# Altium schematic sheet cpu_board.SchDoc
size A3
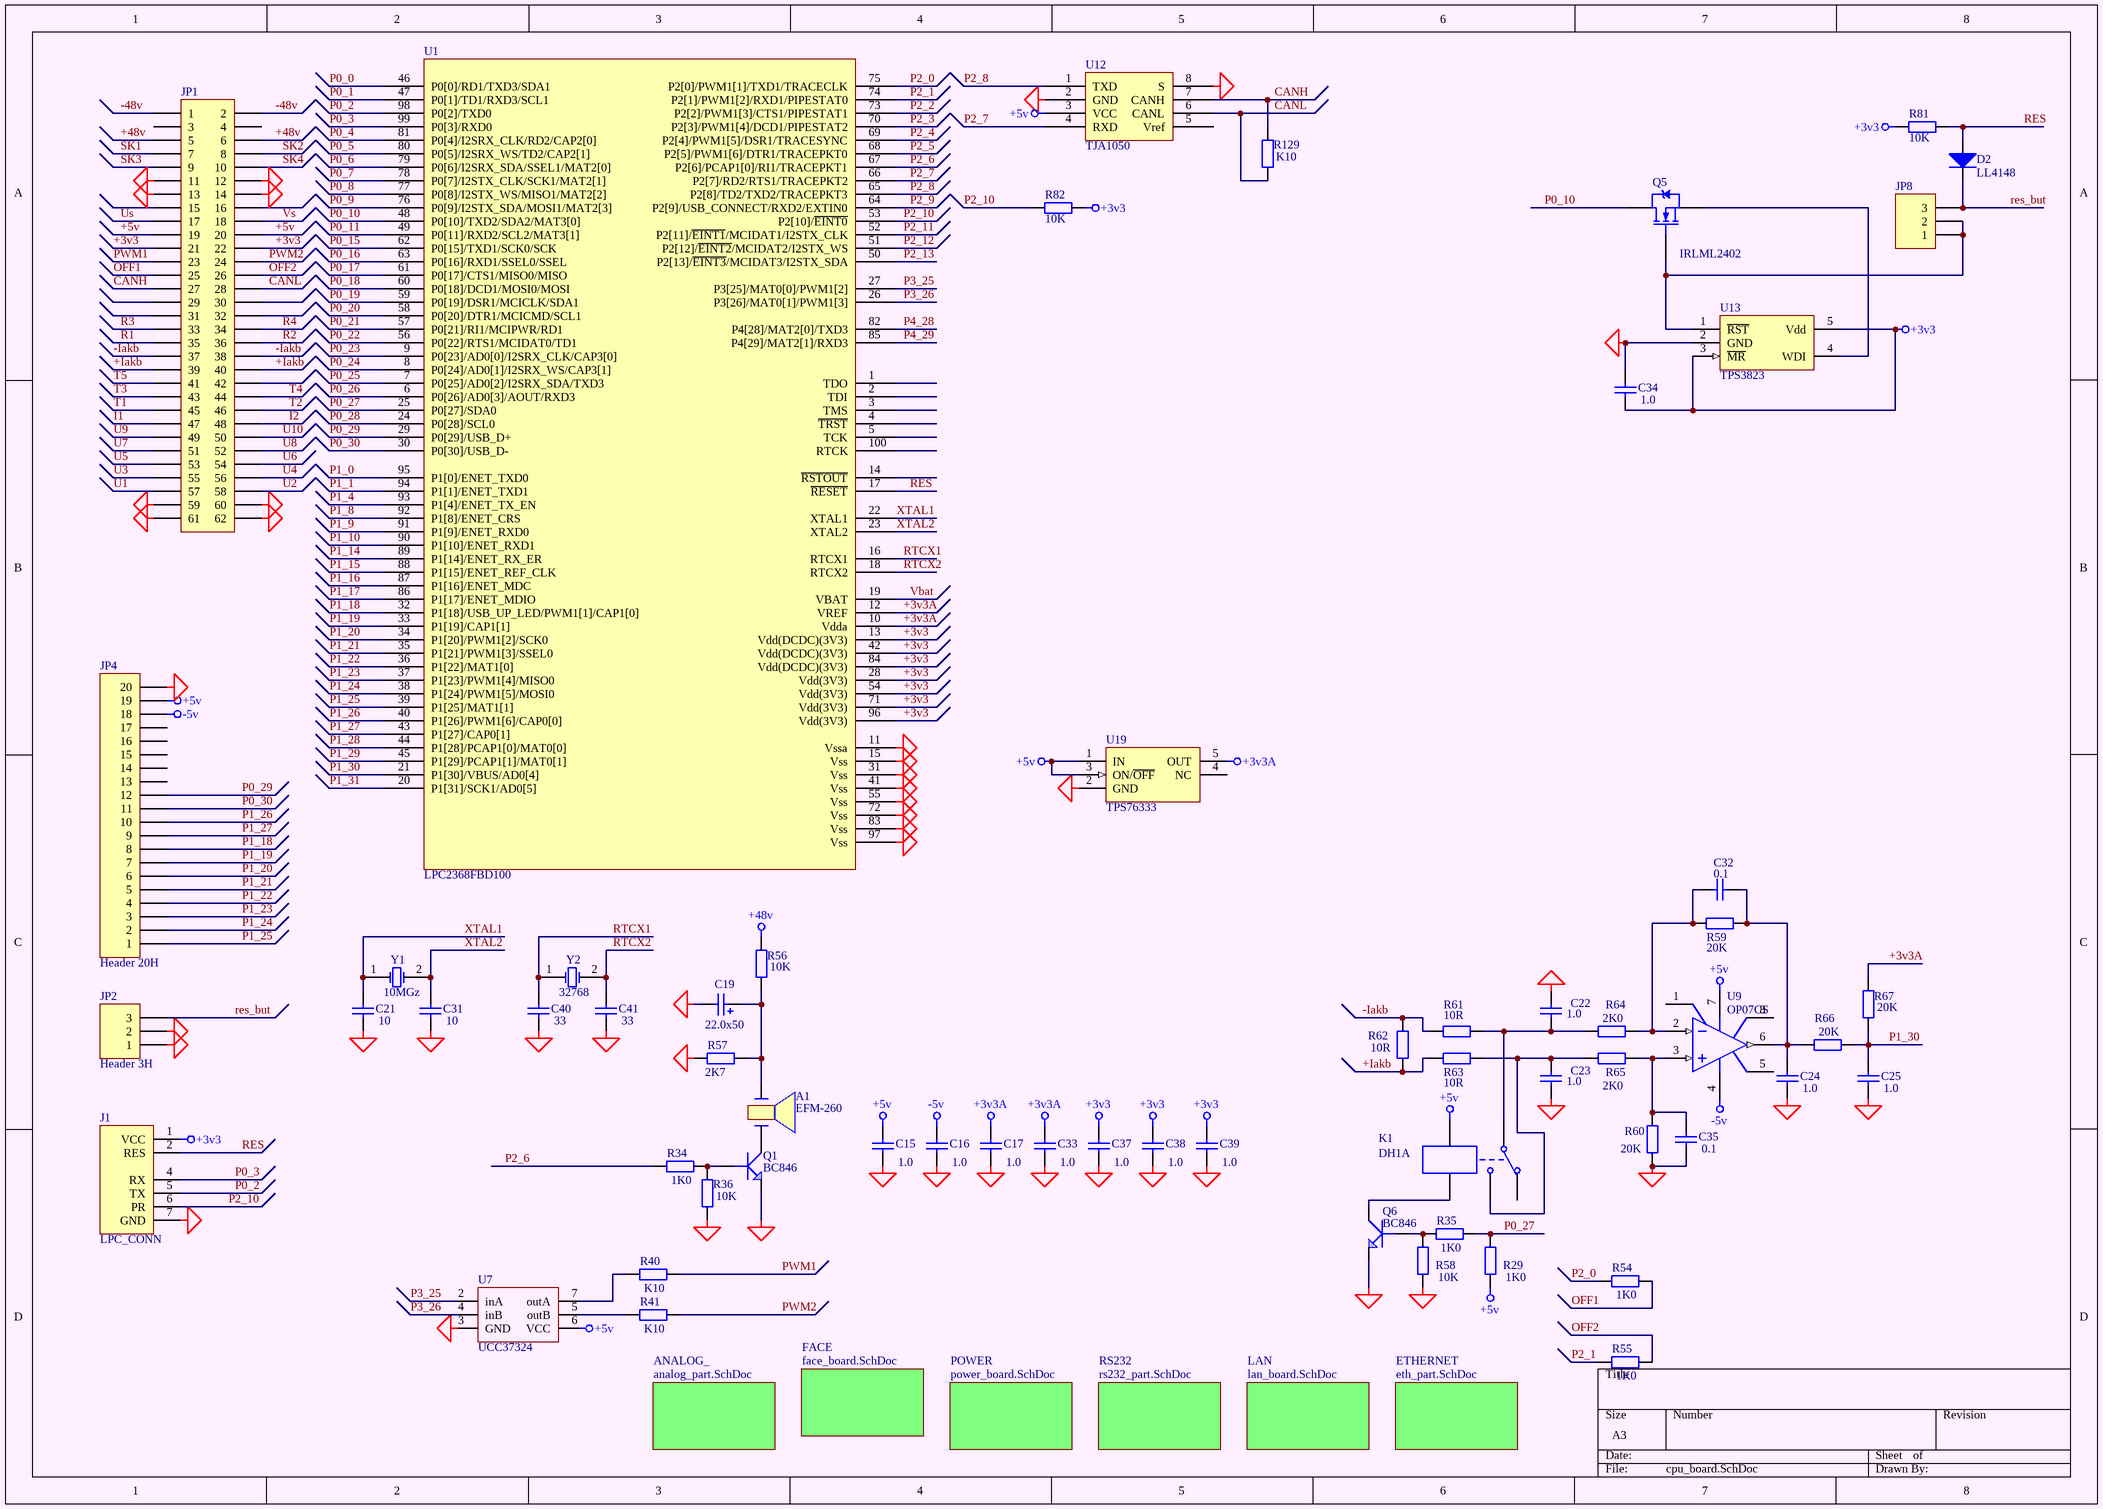
[diagram p0: cpu_board.SchDoc]

## Parts
A1  EFM-260  [Pjezo15]
C15  1.0  [C3216-1206]
C16  1.0  [C3216-1206]
C17  1.0  [_1206]
C19  22.0x50  [el3]
C21  10  [_1206]
C22  1.0  [_1206]
C23  1.0  [_1206]
C24  1.0  [_1206]
C25  1.0  [_1206]
C31  10  [_1206]
C32  0.1  [_1206]
C33  1.0  [_1206]
C34  1.0  [_1206]
C35  0.1  [_1206]
C37  1.0  [_1206]
C38  1.0  [_1206]
C39  1.0  [_1206]
C40  33  [_1206]
C41  33  [_1206]
D2  LL4148  [_1206d]
J1  LPC_CONN  [HDR1X7]
JP1  (no value)  [HDR2X30]
JP2  Header 3H  [HDR1X3H]
JP4  Header 20H  [HDR1X20H]
JP8  PLS-3  [HDR1X3]  (value not drawn)
K1  DH1A  [kuan]
Q1  BC846  [SO-G3]
Q5  IRLML2402  [SO-G3]
Q6  BC846  [SO-G3]
R29  1K0  [_1206]
R34  1K0  [_1206]
R35  1K0  [_1206]
R36  10K  [_1206]
R40  K10  [_1206]
R41  K10  [_1206]
R54  1K0  [_1206]
R55  1K0  [_1206]
R56  10K  [_1206]
R57  2K7  [_1206]
R58  10K  [_1206]
R59  20K  [_1206]
R60  20K  [_1206]
R61  10R  [_1206]
R62  10R  [_1206]
R63  10R  [_1206]
R64  2K0  [_1206]
R65  2K0  [_1206]
R66  20K  [_1206]
R67  20K  [_1206]
R81  10K  [_1206]
R82  10K  [_1206]
R129  K10  [_1206]
U1  LPC2368FBD100  [LPC2368]
U7  UCC37324  [SO-G8]
U9  OP07CS  [SO-G8]
U12  TJA1050  [SO-G8]
U13  TPS3823  [SO-G5/P.95]
U19  TPS76333  [SO-G5/P.95]
Y1  10MGz  [QWARZ1]
Y2  32768  [QWARZ2]

## Sub-sheets
ANALOG_ = analog_part.SchDoc: no entries
ETHERNET = eth_part.SchDoc: no entries
FACE = face_board.SchDoc: no entries
LAN = lan_board.SchDoc: no entries
POWER = power_board.SchDoc: no entries
RS232 = rs232_part.SchDoc: no entries

## Nets
+3v3: C34.1 C37.2 C38.2 C39.2 J1.1(VCC) JP1.21 JP1.22 R81.2 R82.1 U1.13(Vdd(DCDC)(3V3)) U1.28(Vdd(3V3)) U1.42(Vdd(DCDC)(3V3)) U1.54(Vdd(3V3)) U1.71(Vdd(3V3)) U1.84(Vdd(DCDC)(3V3)) U1.96(Vdd(3V3)) U13.3(~{MR}) U13.5(Vdd)
+3v3A: C17.2 C33.2 R67.2 U1.10(Vdda) U1.12(VREF) U19.5(OUT)
+5v: C15.2 JP1.19 JP1.20 JP4.19 K1.4 R29.1 U7.6(VCC) U9.7(V+) U12.3(VCC) U19.1(IN) U19.3(ON/~{OFF})
+48v: JP1.5 JP1.6 R56.2
-5v: C16.2 JP4.18 U9.4(V-)
GND: C15.1 C16.1 C17.1 C19.2 C21.1 C22.1 C23.2 C24.1 C25.1 C31.1 C33.1 C34.2 C35.2 C37.1 C38.1 C39.1 C40.1 C41.1 J1.7(GND) JP1.11 JP1.12 JP1.13 JP1.14 JP1.59 JP1.60 JP1.61 JP1.62 JP2.1 JP2.2 JP4.20 Q1.2(E) Q6.2(E) R36.1 R57.1 R58.1 R60.1 U1.11(Vssa) U1.15(Vss) U1.31(Vss) U1.41(Vss) U1.55(Vss) U1.72(Vss) U1.83(Vss) U1.97(Vss) U7.3(GND) U12.2(GND) U12.8(S) U13.2(GND) U19.2(GND)
+Iakb: JP1.39 JP1.40 R62.1 R63.2
-48v: JP1.1 JP1.2
-Iakb: JP1.37 JP1.38 R61.2 R62.2
CANH: JP1.27 R129.2 U12.7(CANH)
CANL: JP1.28 R129.1 U12.6(CANL)
I1: JP1.47
I2: JP1.48
OFF1: JP1.25 R54.2
OFF2: JP1.26 R55.2
P0_0: U1.46(P0[0]/RD1/TXD3/SDA1)
P0_1: U1.47(P0[1]/TD1/RXD3/SCL1)
P0_2: J1.5(TX) U1.98(P0[2]/TXD0)
P0_3: J1.4(RX) U1.99(P0[3]/RXD0)
P0_4: U1.81(P0[4]/I2SRX_CLK/RD2/CAP2[0])
P0_5: U1.80(P0[5]/I2SRX_WS/TD2/CAP2[1])
P0_6: U1.79(P0[6]/I2SRX_SDA/SSEL1/MAT2[0])
P0_7: U1.78(P0[7]/I2STX_CLK/SCK1/MAT2[1])
P0_8: U1.77(P0[8]/I2STX_WS/MISO1/MAT2[2])
P0_9: U1.76(P0[9]/I2STX_SDA/MOSI1/MAT2[3])
P0_10: Q5.3(D) U1.48(P0[10]/TXD2/SDA2/MAT3[0])
P0_11: U1.49(P0[11]/RXD2/SCL2/MAT3[1])
P0_15: U1.62(P0[15]/TXD1/SCK0/SCK)
P0_16: U1.63(P0[16]/RXD1/SSEL0/SSEL)
P0_17: U1.61(P0[17]/CTS1/MISO0/MISO)
P0_18: U1.60(P0[18]/DCD1/MOSI0/MOSI)
P0_19: U1.59(P0[19]/DSR1/MCICLK/SDA1)
P0_20: U1.58(P0[20]/DTR1/MCICMD/SCL1)
P0_21: U1.57(P0[21]/RI1/MCIPWR/RD1)
P0_22: U1.56(P0[22]/RTS1/MCIDAT0/TD1)
P0_23: U1.9(P0[23]/AD0[0]/I2SRX_CLK/CAP3[0])
P0_24: U1.8(P0[24]/AD0[1]/I2SRX_WS/CAP3[1])
P0_25: U1.7(P0[25]/AD0[2]/I2SRX_SDA/TXD3)
P0_26: U1.6(P0[26]/AD0[3]/AOUT/RXD3)
P0_27: R29.2 R35.1 U1.25(P0[27]/SDA0)
P0_28: U1.24(P0[28]/SCL0)
P0_29: JP4.12 U1.29(P0[29]/USB_D+)
P0_30: JP4.11 U1.30(P0[30]/USB_D-)
P1_0: U1.95(P1[0]/ENET_TXD0)
P1_1: U1.94(P1[1]/ENET_TXD1)
P1_4: U1.93(P1[4]/ENET_TX_EN)
P1_8: U1.92(P1[8]/ENET_CRS)
P1_9: U1.91(P1[9]/ENET_RXD0)
P1_10: U1.90(P1[10]/ENET_RXD1)
P1_14: U1.89(P1[14]/ENET_RX_ER)
P1_15: U1.88(P1[15]/ENET_REF_CLK)
P1_16: U1.87(P1[16]/ENET_MDC)
P1_17: U1.86(P1[17]/ENET_MDIO)
P1_18: JP4.8 U1.32(P1[18]/USB_UP_LED/PWM1[1]/CAP1[0])
P1_19: JP4.7 U1.33(P1[19]/CAP1[1])
P1_20: JP4.6 U1.34(P1[20]/PWM1[2]/SCK0)
P1_21: JP4.5 U1.35(P1[21]/PWM1[3]/SSEL0)
P1_22: JP4.4 U1.36(P1[22]/MAT1[0])
P1_23: JP4.3 U1.37(P1[23]/PWM1[4]/MISO0)
P1_24: JP4.2 U1.38(P1[24]/PWM1[5]/MOSI0)
P1_25: JP4.1 U1.39(P1[25]/MAT1[1])
P1_26: JP4.10 U1.40(P1[26]/PWM1[6]/CAP0[0])
P1_27: JP4.9 U1.43(P1[27]/CAP0[1])
P1_28: U1.44(P1[28]/PCAP1[0]/MAT0[0])
P1_29: U1.45(P1[29]/PCAP1[1]/MAT0[1])
P1_30: C25.2 R66.2 R67.1 U1.21(P1[30]/VBUS/AD0[4])
P1_31: U1.20(P1[31]/SCK1/AD0[5])
P2_0: R54.1 U1.75(P2[0]/PWM1[1]/TXD1/TRACECLK)
P2_1: R55.1 U1.74(P2[1]/PWM1[2]/RXD1/PIPESTAT0)
P2_2: U1.73(P2[2]/PWM1[3]/CTS1/PIPESTAT1)
P2_3: U1.70(P2[3]/PWM1[4]/DCD1/PIPESTAT2)
P2_4: U1.69(P2[4]/PWM1[5]/DSR1/TRACESYNC)
P2_5: U1.68(P2[5]/PWM1[6]/DTR1/TRACEPKT0)
P2_6: R34.1 U1.67(P2[6]/PCAP1[0]/RI1/TRACEPKT1)
P2_7: U1.66(P2[7]/RD2/RTS1/TRACEPKT2) U12.4(RXD)
P2_8: U1.65(P2[8]/TD2/TXD2/TRACEPKT3) U12.1(TXD)
P2_9: U1.64(P2[9]/USB_CONNECT/RXD2/EXTIN0)
P2_10: J1.6(PR) R82.2 U1.53(P2[10]/~{EINT0})
P2_11: U1.52(P2[11]/~{EINT1}/MCIDAT1/I2STX_CLK)
P2_12: U1.51(P2[12]/~{EINT2}/MCIDAT2/I2STX_WS)
P2_13: U1.50(P2[13]/~{EINT3}/MCIDAT3/I2STX_SDA)
P3_25: U1.27(P3[25]/MAT0[0]/PWM1[2]) U7.2(inA)
P3_26: U1.26(P3[26]/MAT0[1]/PWM1[3]) U7.4(inB)
P4_28: U1.82(P4[28]/MAT2[0]/TXD3)
P4_29: U1.85(P4[29]/MAT2[1]/RXD3)
PWM1: JP1.23 R40.1
PWM2: JP1.24 R41.1
R1: JP1.35
R2: JP1.36
R3: JP1.33
R4: JP1.34
RES: D2.1(A) J1.2(RES) R81.1 U1.17(~{RESET})
res_but: D2.2(K) JP2.3 JP8.3
RTCX1: C40.2 U1.16(RTCX1) Y2.1(OSC1)
RTCX2: C41.2 U1.18(RTCX2) Y2.2(OSC2)
SK1: JP1.7
SK2: JP1.8
SK3: JP1.9
SK4: JP1.10
T1: JP1.45
T2: JP1.46
T3: JP1.43
T4: JP1.44
T5: JP1.41
U1: JP1.57
U2: JP1.58
U3: JP1.55
U4: JP1.56
U5: JP1.53
U6: JP1.54
U7: JP1.51
U8: JP1.52
U9: JP1.49
U10: JP1.50
Us: JP1.17
Vbat: U1.19(VBAT)
Vs: JP1.18
XTAL1: C21.2 U1.22(XTAL1) Y1.1(OSC1)
XTAL2: C31.2 U1.23(XTAL2) Y1.2(OSC2)
NetA1_1: A1.1 Q1.3(C)
NetA1_2: A1.2 C19.1 R56.1 R57.2
NetC22_2: C22.2 K1.1 R61.1 R64.1
NetC23_1: C23.1 K1.3 R63.1 R65.1
NetC24_2: C24.2 C32.2 R59.1 R66.1 U9.6(OUT)
NetC32_1: C32.1 R59.2 R64.2 U9.2(IN-)
NetC35_1: C35.1 R60.2 R65.2 U9.3(IN+)
NetJP8_1: JP8.1 JP8.2 Q5.1(G) U13.1(~{RST})
NetK1_5: K1.5 Q6.3(C)
NetQ1_1: Q1.1(B) R34.2 R36.2
NetQ5_2: Q5.2(S) U13.4(WDI)
NetQ6_1: Q6.1(B) R35.2 R58.2
NetR40_2: R40.2 U7.7(outA)
NetR41_2: R41.2 U7.5(outB)

Not connected (* = marked no-connect by the designer): JP1 3 4 15 16 29 30 31 32 42; JP4 13 14 15 16 17; K1 2; U1 1(TDO) 2(TDI) 3(TMS) 4(~{TRST}) 5(TCK) 14(~{RSTOUT}) 100(RTCK); U9 1(VOSTRIM) 5(NC) 8(VOSTRIM); U12 5(Vref); U19 4(NC)

## Library data of the parts
A1 = PJEZ0
C15-C17 C32 C33 C35 C37-C39 = Cap Semi: Capacitor (Semiconductor SIM Model); Manufacturer: Generic Components; Class I: Passive; Value: 0,1; Published: 8-Jun-2000; Revision: July-2002: Re-released for DXP Platform.; Publisher: Altium Limited; Class II: Capacitor
C19 = Cap Pol1: Polarized Capacitor (Radial); Manufacturer: Generic Components; Class I: Passive; Value: 22,0; Published: 8-Jun-2000; Revision: July-2002: Re-released for DXP Platform.; Publisher: Altium Limited; Class II: Capacitor
C21 C31 C40 C41 = Cap Semi: Capacitor (Semiconductor SIM Model); Manufacturer: Generic Components; Class I: Passive; Value: 15pF; Published: 8-Jun-2000; Revision: July-2002: Re-released for DXP Platform.; Publisher: Altium Limited; Class II: Capacitor
C22-C25 = Cap Semi: Capacitor (Semiconductor SIM Model); Manufacturer: Generic Components; Class I: Passive; Value: 1,0; Published: 8-Jun-2000; Revision: July-2002: Re-released for DXP Platform.; Publisher: Altium Limited; Class II: Capacitor
C34 = Cap Semi: Capacitor; Manufacturer: Generic Components; Class I: Passive; Value: 0,1; Published: 8-Jun-2000; Revision: July-2002: Re-released for DXP Platform.; Publisher: Altium Limited; Class II: Capacitor
D2 = Diode: Default Diode; Manufacturer: Generic Components; Class I: Discrete; Class II: Diode - Switching; Published: 8-Jun-2000; Revision: July-2002: Re-released for DXP Platform.; Publisher: Altium Limited
JP1 = Header 31X2: Header, 30-Pin, Dual row; Manufacturer: Generic Components; Class I: Connector; Revision: July-2002: Re-released for DXP Platform.; Publisher: Altium Limited
JP2 = Header 3H: Header, 3-Pin,  Right Angle; Manufacturer: Generic Components; Class I: Connector; Revision: July-2002: Re-released for DXP Platform.; Publisher: Altium Limited
JP4 = Header 20H: Header, 20-Pin,  Right Angle; Manufacturer: Generic Components; Class I: Connector; Revision: July-2002: Re-released for DXP Platform.; Publisher: Altium Limited
JP8 = Header 3: Header, 3-Pin; Manufacturer: Generic Components; Class I: Connector; Revision: July-2002: Re-released for DXP Platform.; Publisher: Altium Limited
K1 = BS115: Single-Pole Dual-Throw Relay; Manufacturer: Generic Components; Class I: Electro-mechanical; Published: 24-Mar-1999; Revision: July-2002: Re-released for DXP Platform.; Publisher: Altium Limited; Class II: Relay
Q1 Q6 = GT122: Right: 20; Bottom: 20
Q5 = IRLML2402: HEXFET Power MOSFET; Manufacturer: International Rectifier; Class I: Discrete; Class II: MOSFET - Power; Published: 8-Jun-2000; Revision: July-2002: Re-released for DXP Platform.; Datasheet: Latest Revision: Aug-1997; Package Reference: SOT-23; Publisher: Altium Limited; Value: IRLML2402
R29 = Res2: Resistor; Manufacturer: Generic Components; Class I: Passive; Value: 10K; Published: 8-Jun-2000; Revision: July-2002: Re-released for DXP Platform.; Publisher: Altium Limited; Class II: Resistor
R34 R35 R40 R41 R54-R57 R61-R63 R81 R82 = Res2: Resistor; Manufacturer: Generic Components; Class I: Passive; Rule: Undefined; Published: 8-Jun-2000; Revision: July-2002: Re-released for DXP Platform.; Publisher: Altium Limited; Class II: Resistor
  R34 R35 R54 R55: Value: 1K0
  R40 R41: Value: K10
  R56 R81 R82: Value: 10K
  R57: Value: 2K7
  R61-R63: Value: 10R
R36 R58-R60 R64-R67 = Res2: Resistor; Manufacturer: Generic Components; Class I: Passive; Published: 8-Jun-2000; Revision: July-2002: Re-released for DXP Platform.; Publisher: Altium Limited; Class II: Resistor
  R36 R58: Value: 10K
  R59 R60 R66 R67: Value: 20K
  R64 R65: Value: 2K0
R129 = Res2: Resistor; Manufacturer: Generic Components; Class I: Passive; Value: 120; Published: 8-Jun-2000; Revision: July-2002: Re-released for DXP Platform.; Publisher: Altium Limited; Class II: Resistor
U9 = OP07CS: Ultra-Low Offset Voltage Operational Amplifier; Manufacturer: Analog Devices; Note: Pin 5 is not connected.; Published: 8-Jun-2000; Revision: July-2002: Re-released for DXP Platform.; Datasheet: Designer's Reference Manual CD (1992); Package Reference: SO-8B; Publisher: Altium Limited; Class I: Amplifier; Class II: Operational Amplifier
U13 = TPS3823: Reset IC; Manufacturer: National Semiconductor; Package Information: Latest Revision: Aug-1999; Class I: Power Management; Class II: Voltage Regulator; Value: TPS76333; Published: 15-Apr-2002; Datasheet: Latest Revision: Oct-1999; Package Reference: MA05B; Publisher: Altium Limited
U19 = LP2980AIM5-3.3: Micropower SOT, 50 mA Ultra Low-Dropout Regulator; Manufacturer: National Semiconductor; Package Information: Latest Revision: Aug-1999; Class I: Power Management; Class II: Voltage Regulator; Published: 15-Apr-2002; Datasheet: Latest Revision: Oct-1999; Package Reference: MA05B; Publisher: Altium Limited
Y1 Y2 = XTAL: Crystal Oscillator; Manufacturer: Generic Components; Published: 8-Jun-2000; Revision: July-2002: Re-released for DXP Platform.; Publisher: Altium Limited; Class I: Oscillator; Class II: Crystal Oscillator